# EAGLE schematic hanover-7320-20-01 (EAGLE 9.6.1), part 3 of 4
## Sheet 6 of 7: Dots R17-32 C1-16
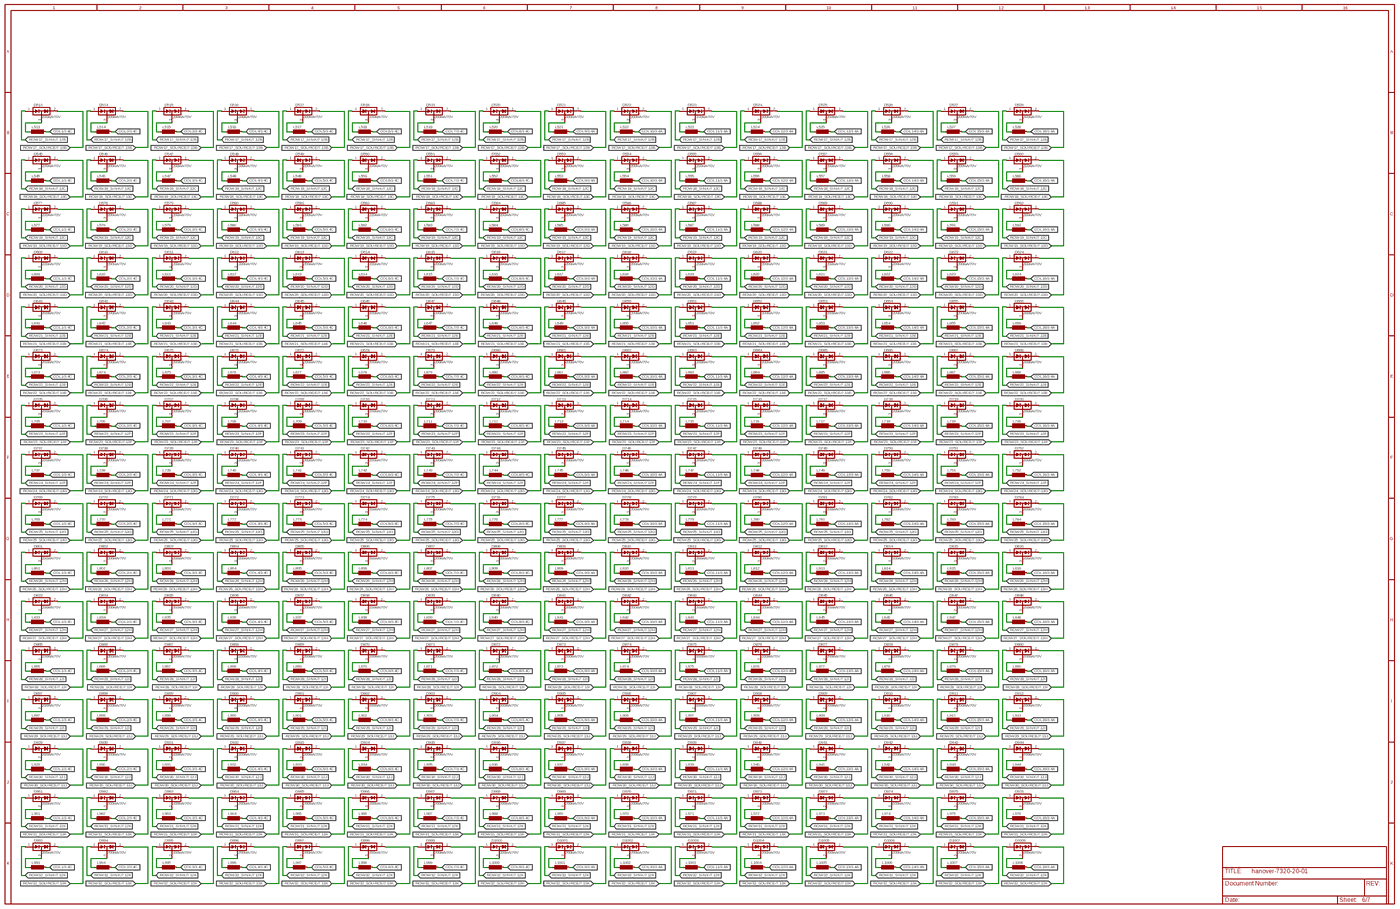
[diagram p9: schematic, sheet 6, overview]
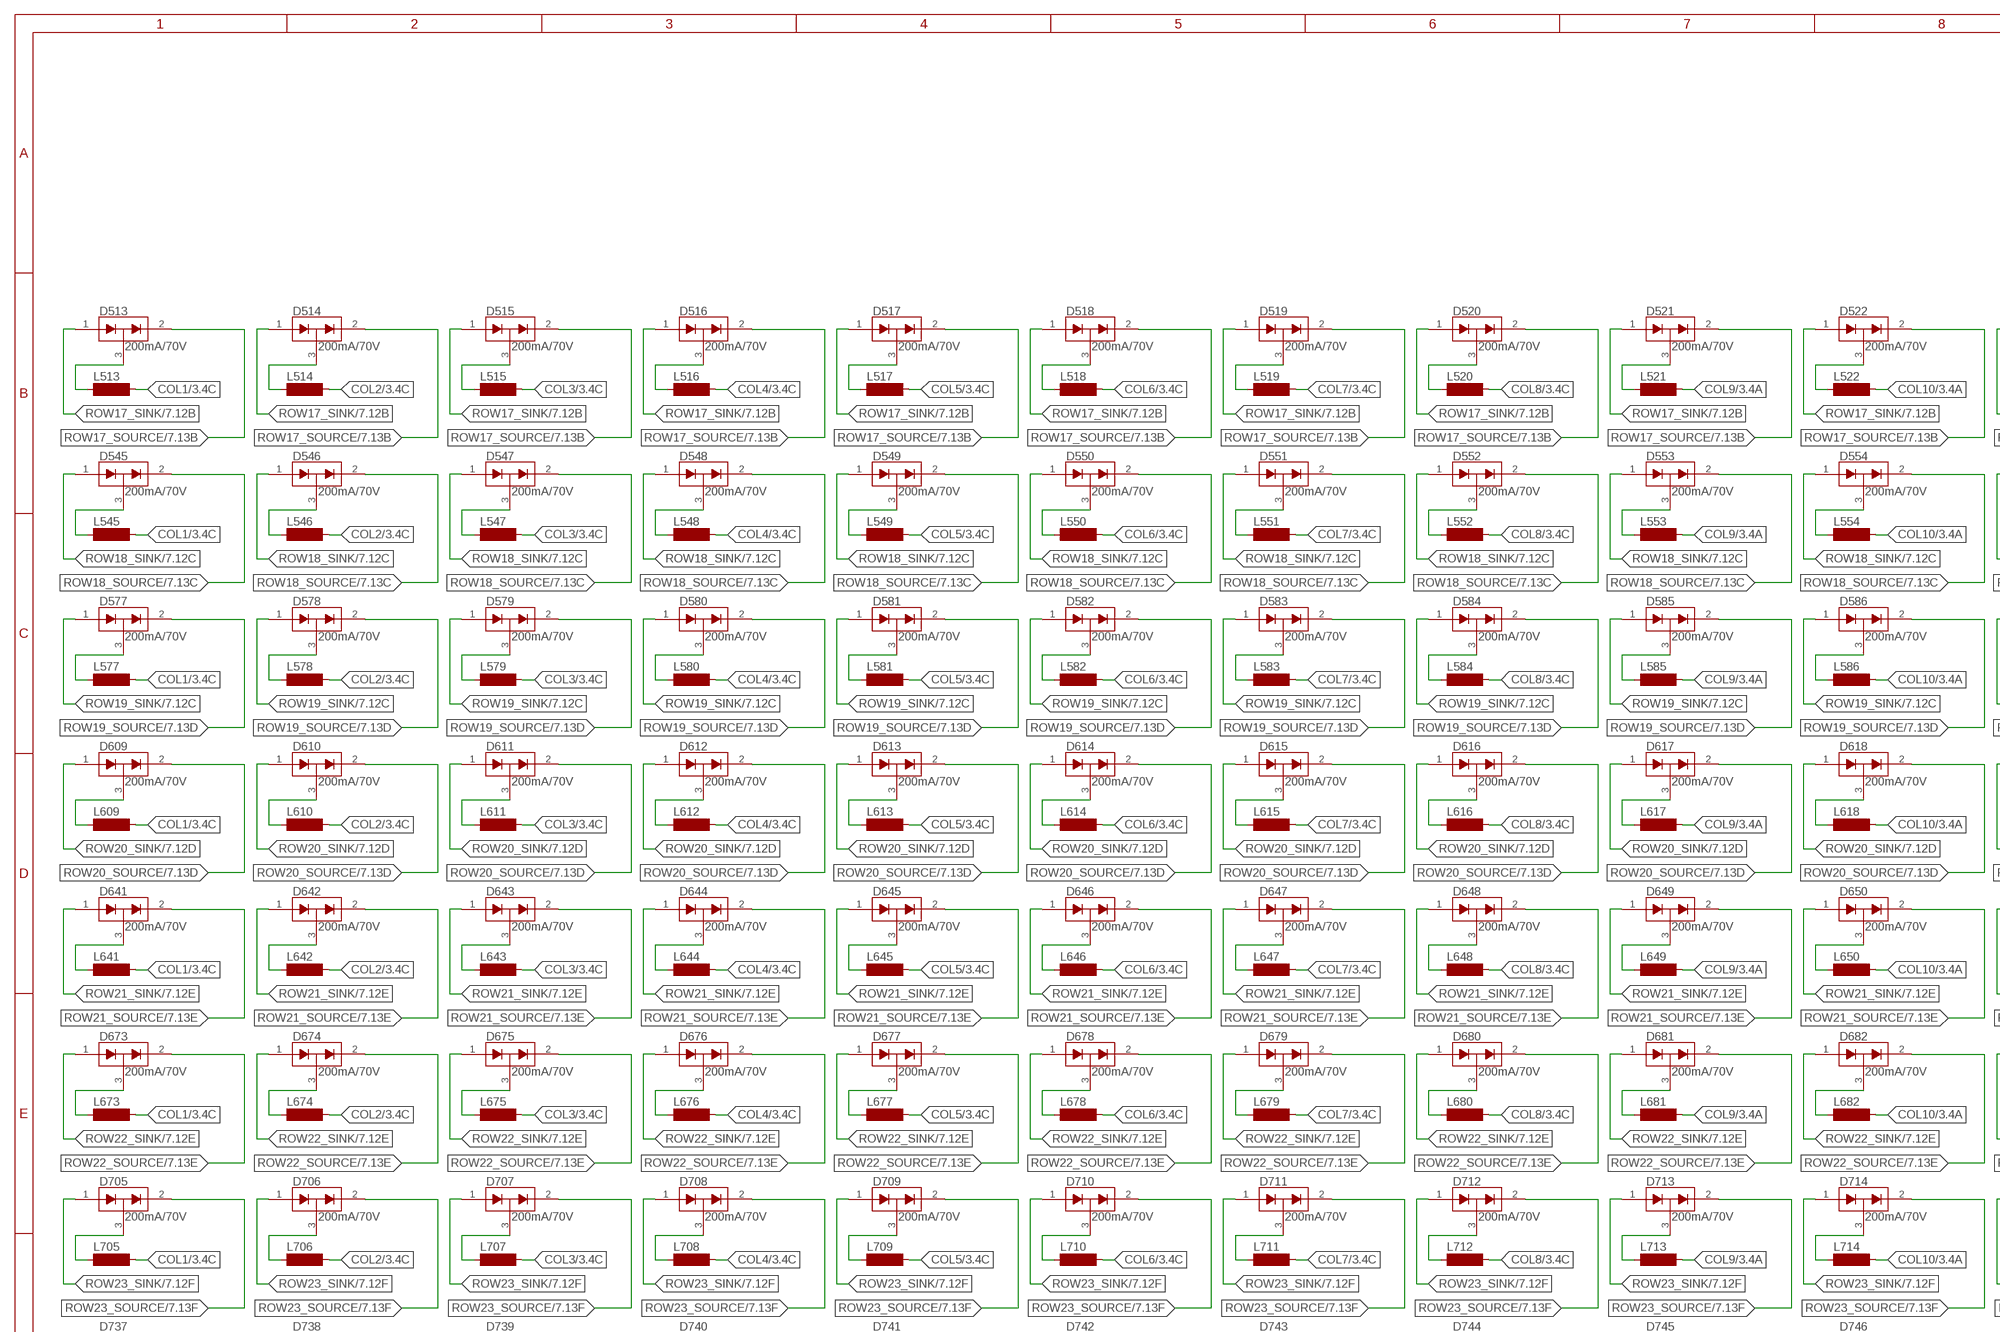
[diagram p10: schematic, sheet 6, part 1 of 4]
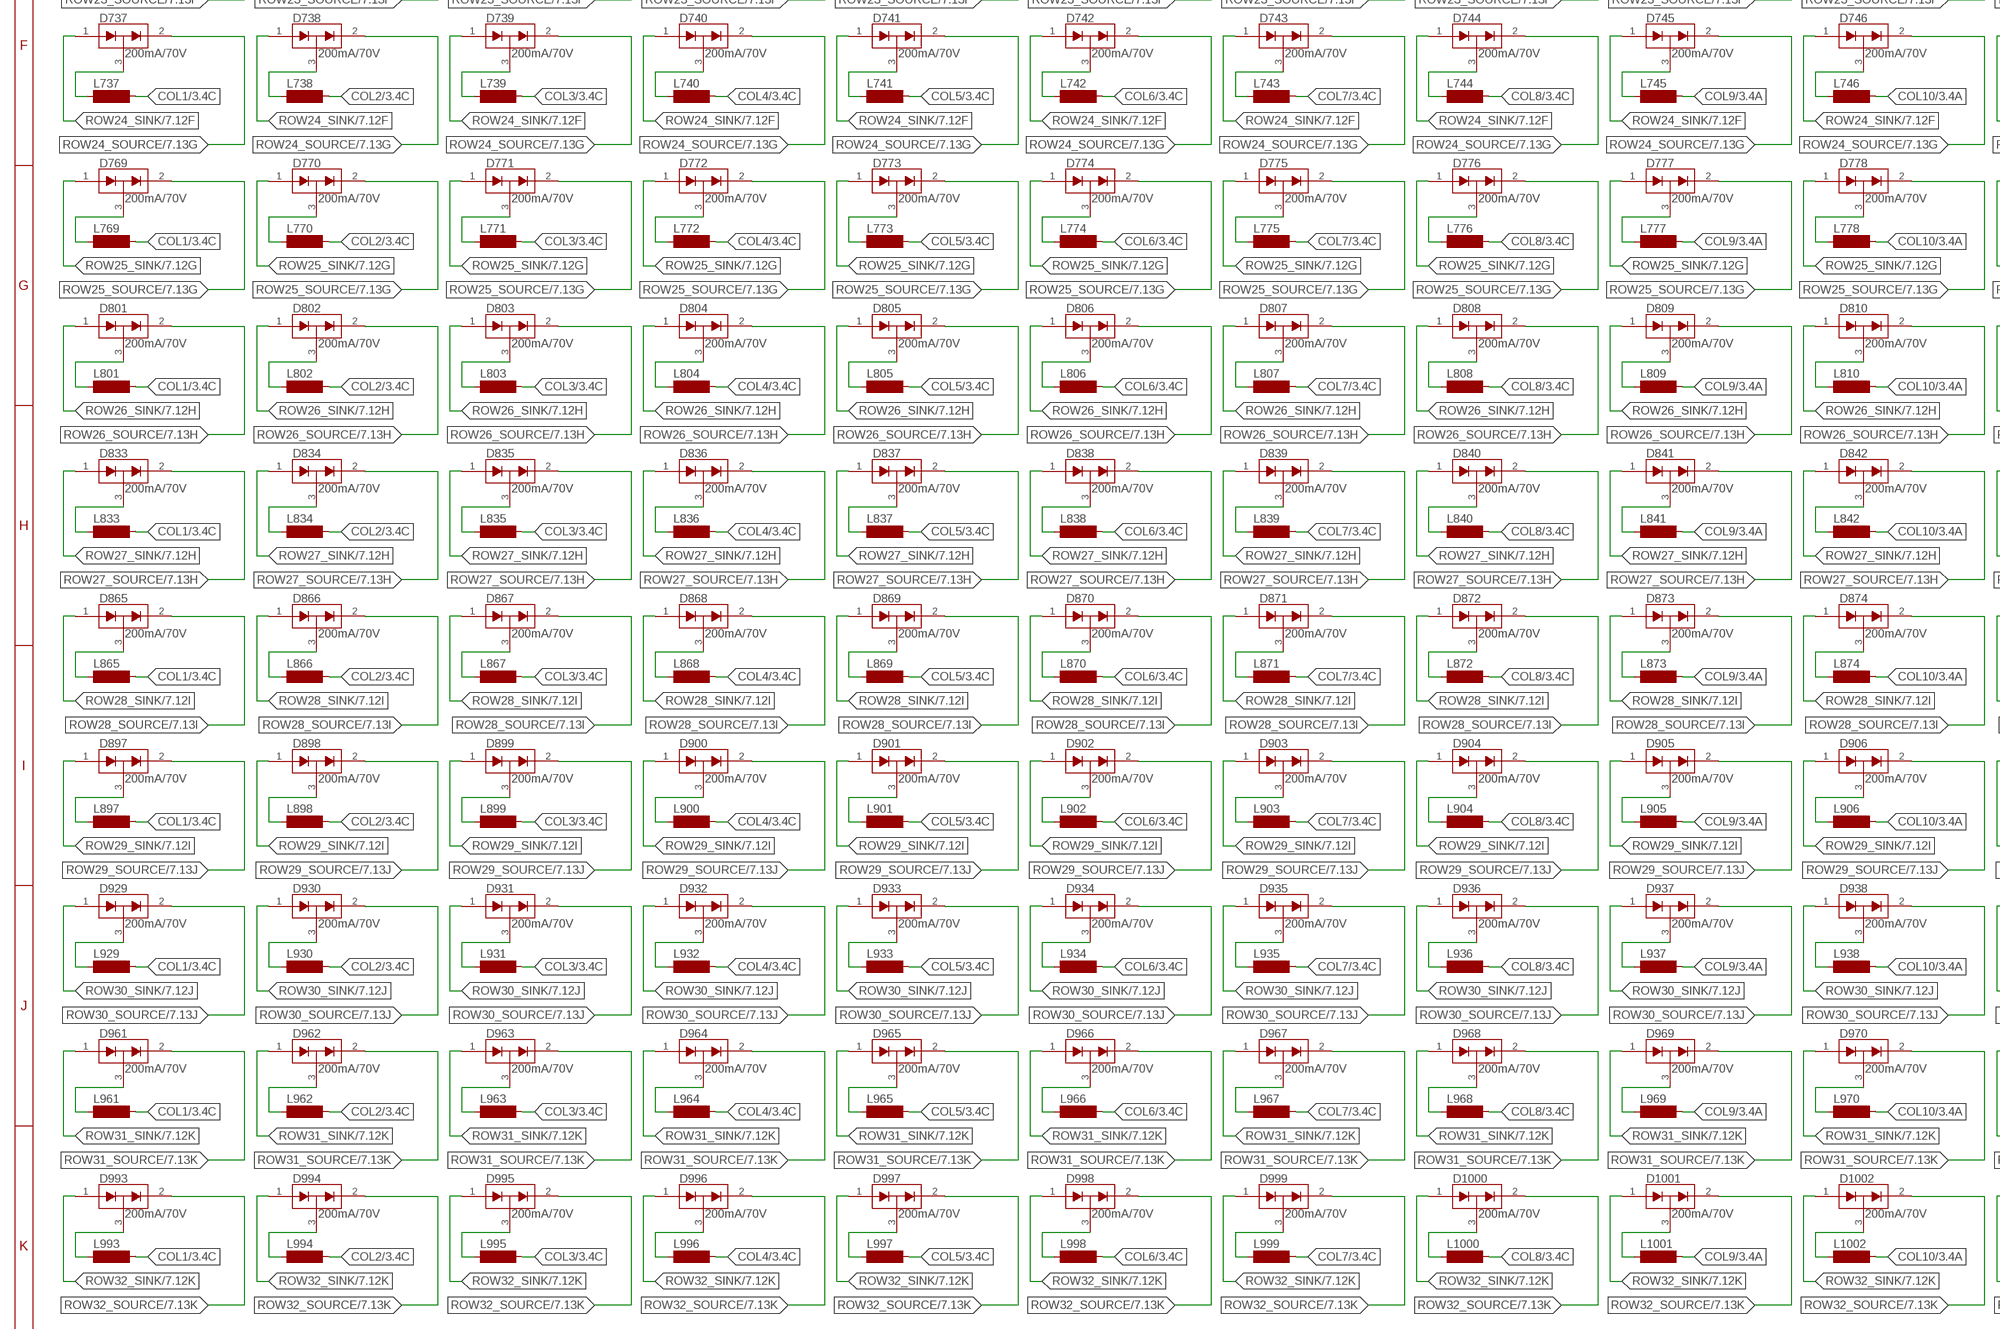
[diagram p11: schematic, sheet 6, part 2 of 4]
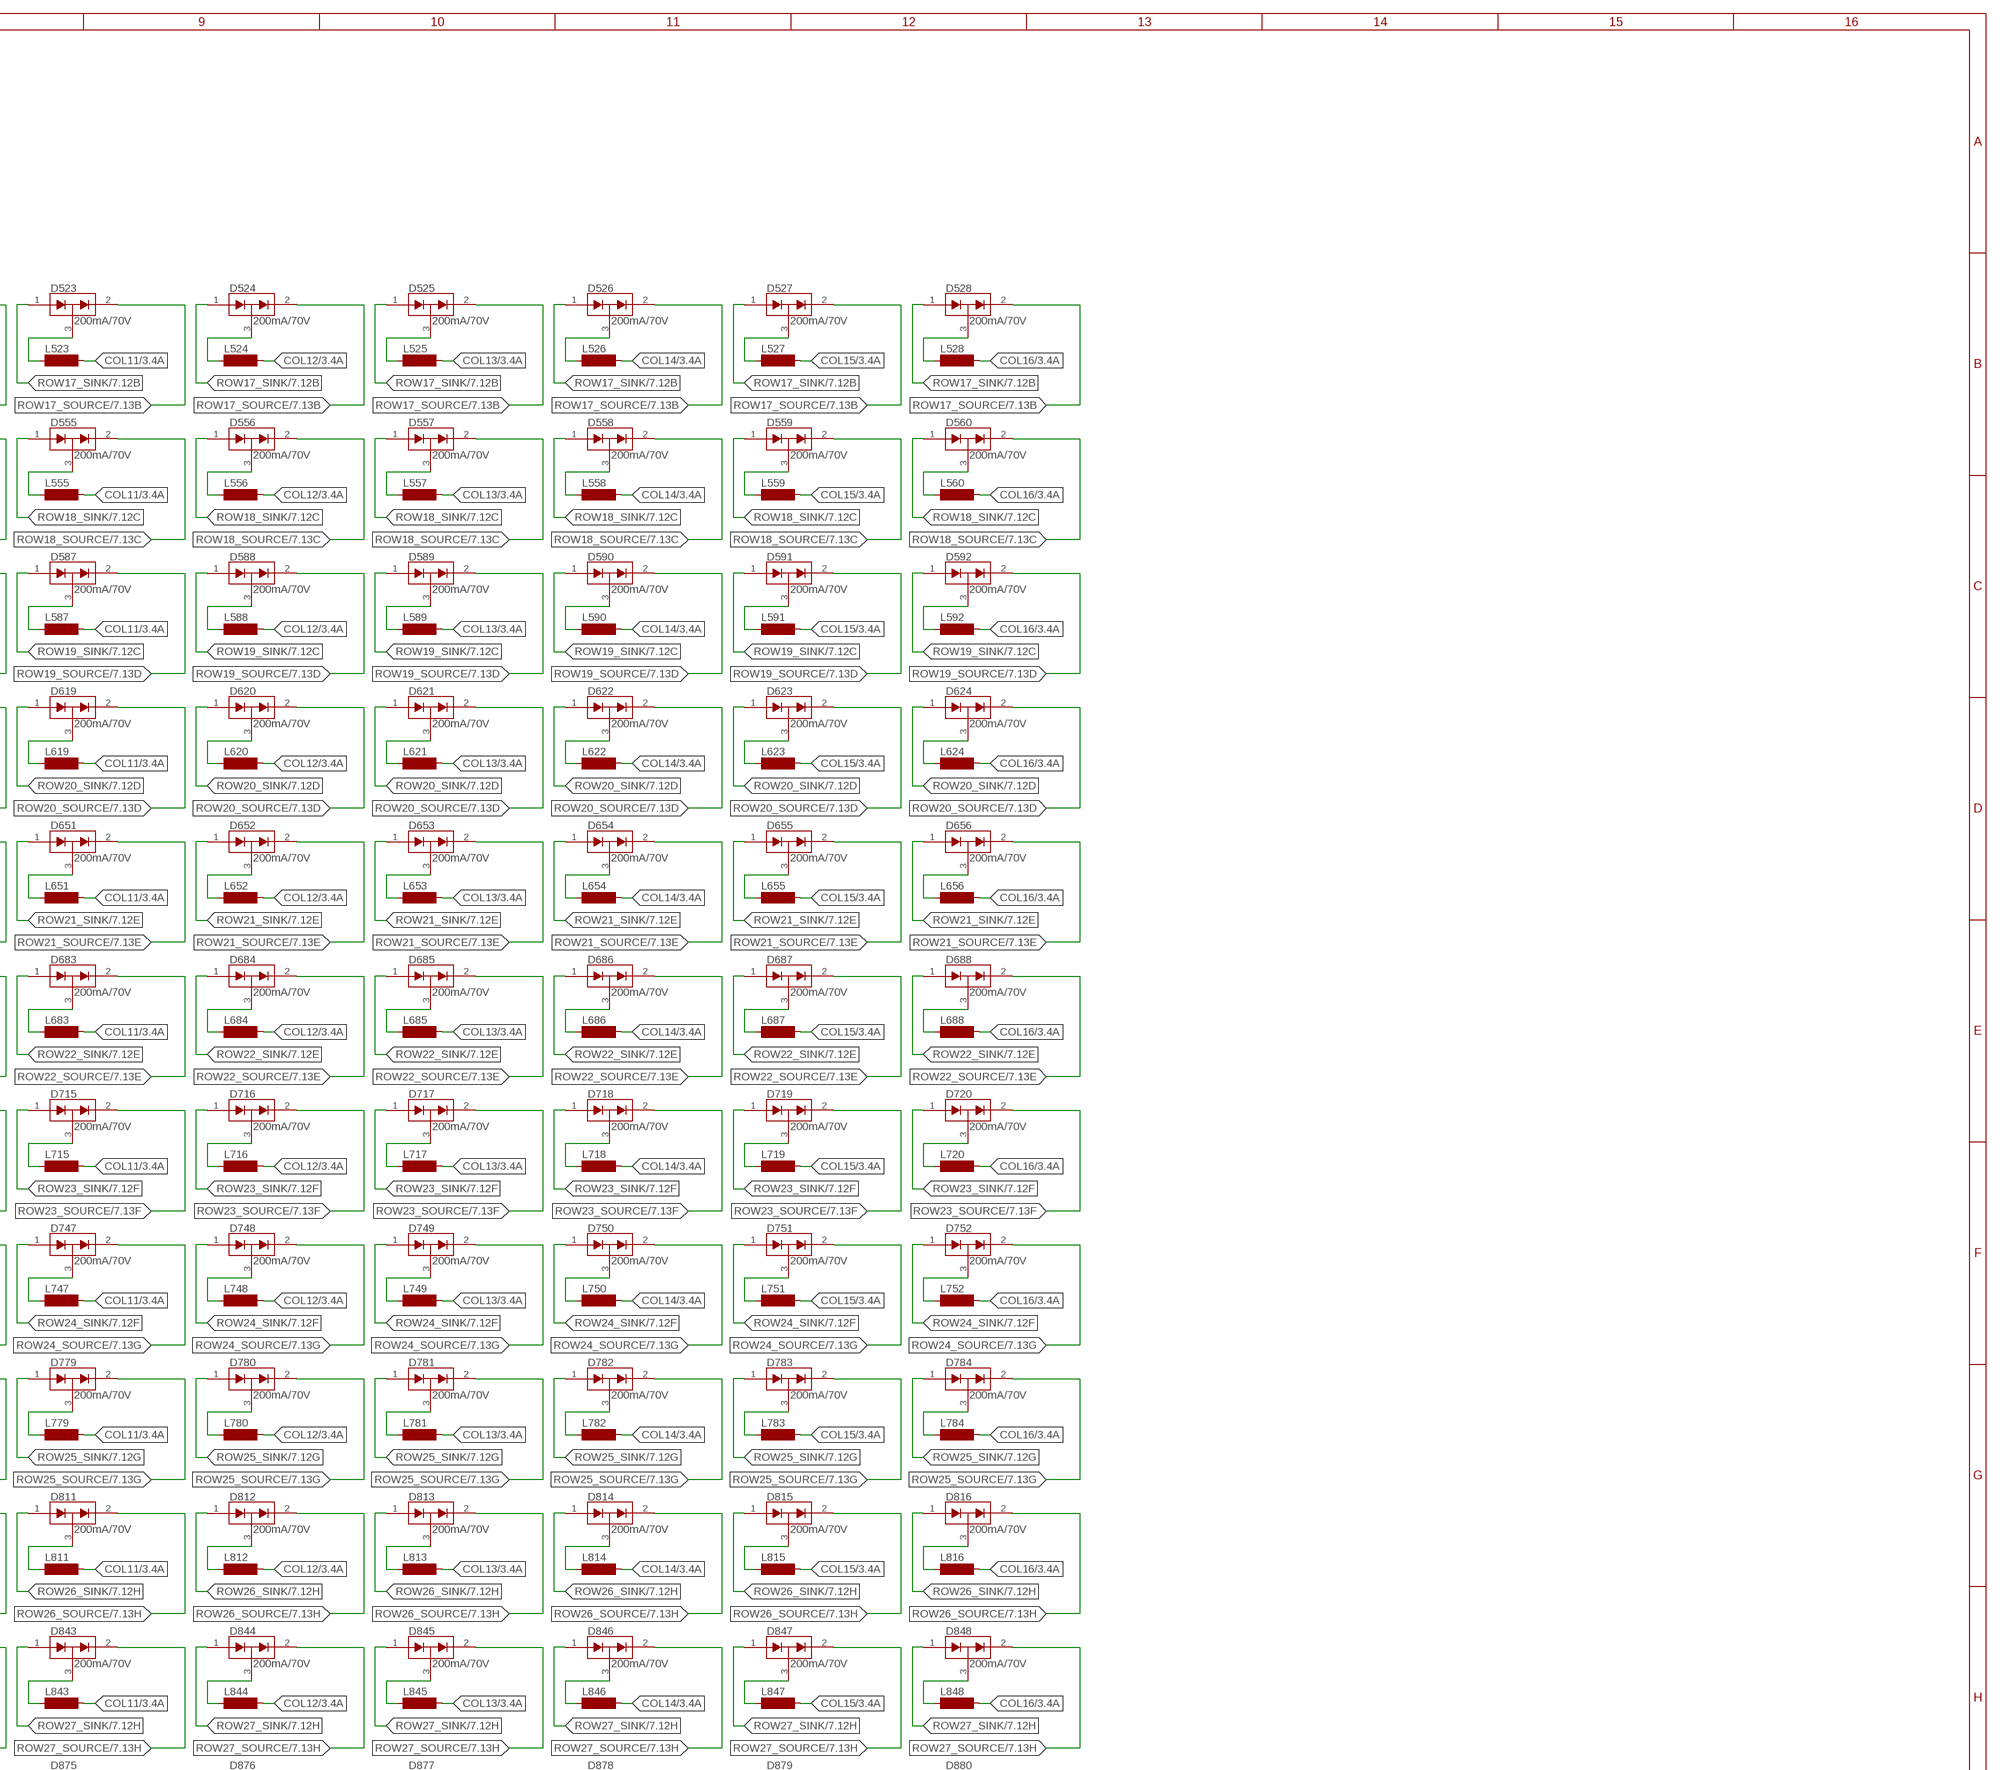
[diagram p12: schematic, sheet 6, part 3 of 4]
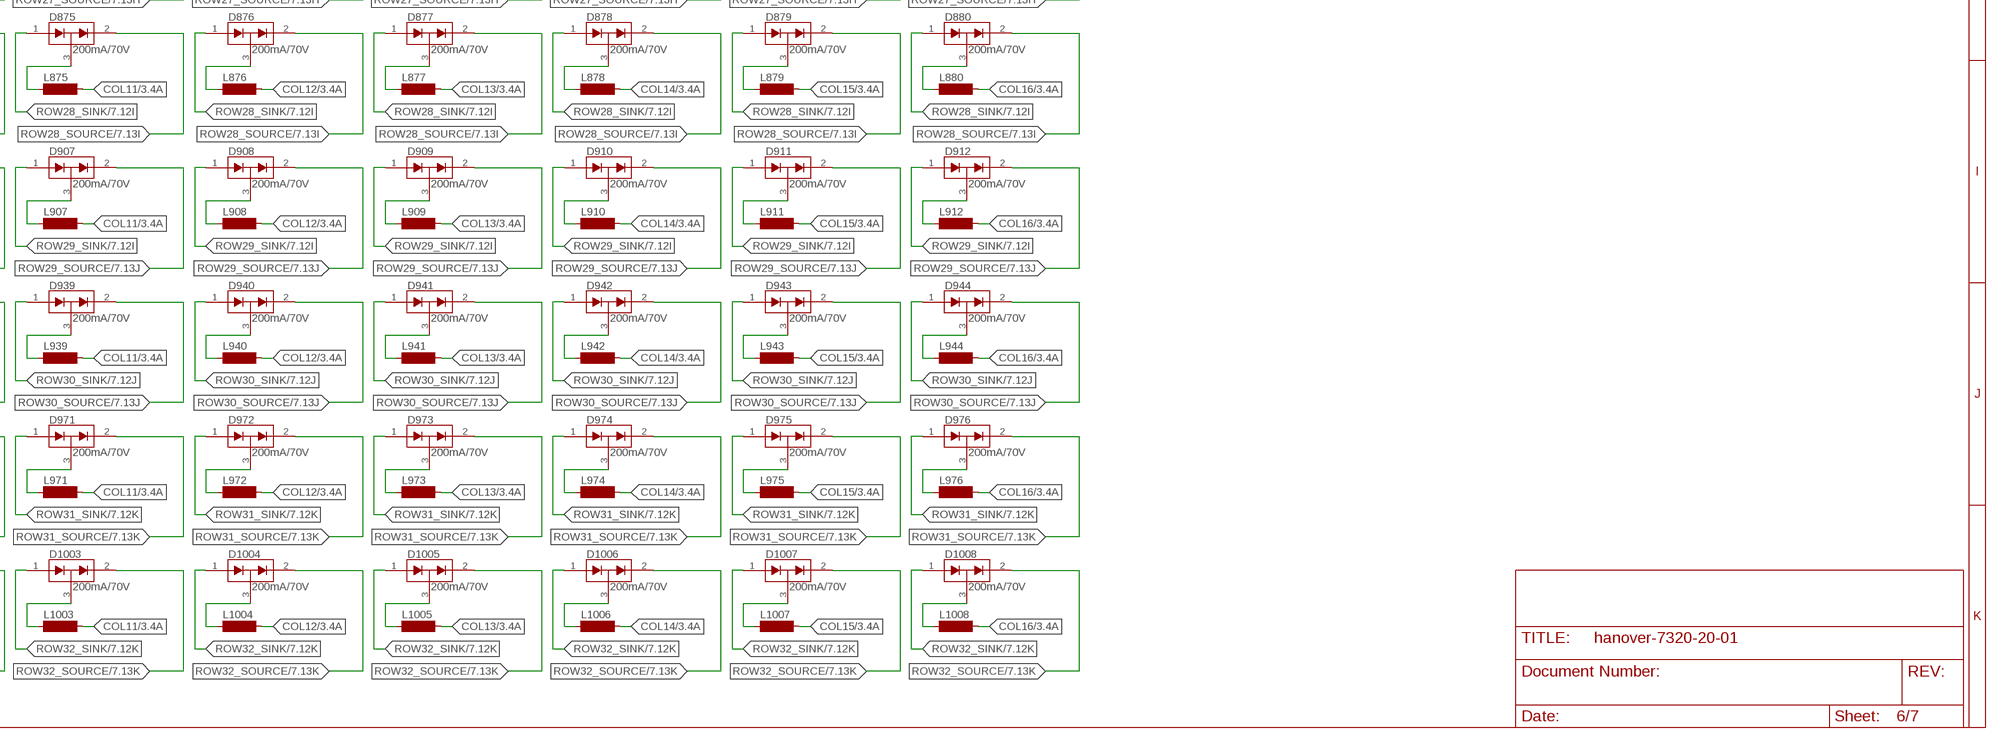
[diagram p13: schematic, sheet 6, part 4 of 4]

### Parts
D513  200mA/70V  BAV99  [SOT23-3]
D514  200mA/70V  BAV99  [SOT23-3]
D515  200mA/70V  BAV99  [SOT23-3]
D516  200mA/70V  BAV99  [SOT23-3]
D517  200mA/70V  BAV99  [SOT23-3]
D518  200mA/70V  BAV99  [SOT23-3]
D519  200mA/70V  BAV99  [SOT23-3]
D520  200mA/70V  BAV99  [SOT23-3]
D521  200mA/70V  BAV99  [SOT23-3]
D522  200mA/70V  BAV99  [SOT23-3]
D523  200mA/70V  BAV99  [SOT23-3]
D524  200mA/70V  BAV99  [SOT23-3]
D525  200mA/70V  BAV99  [SOT23-3]
D526  200mA/70V  BAV99  [SOT23-3]
D527  200mA/70V  BAV99  [SOT23-3]
D528  200mA/70V  BAV99  [SOT23-3]
D545  200mA/70V  BAV99  [SOT23-3]
D546  200mA/70V  BAV99  [SOT23-3]
D547  200mA/70V  BAV99  [SOT23-3]
D548  200mA/70V  BAV99  [SOT23-3]
D549  200mA/70V  BAV99  [SOT23-3]
D550  200mA/70V  BAV99  [SOT23-3]
D551  200mA/70V  BAV99  [SOT23-3]
D552  200mA/70V  BAV99  [SOT23-3]
D553  200mA/70V  BAV99  [SOT23-3]
D554  200mA/70V  BAV99  [SOT23-3]
D555  200mA/70V  BAV99  [SOT23-3]
D556  200mA/70V  BAV99  [SOT23-3]
D557  200mA/70V  BAV99  [SOT23-3]
D558  200mA/70V  BAV99  [SOT23-3]
D559  200mA/70V  BAV99  [SOT23-3]
D560  200mA/70V  BAV99  [SOT23-3]
D577  200mA/70V  BAV99  [SOT23-3]
D578  200mA/70V  BAV99  [SOT23-3]
D579  200mA/70V  BAV99  [SOT23-3]
D580  200mA/70V  BAV99  [SOT23-3]
D581  200mA/70V  BAV99  [SOT23-3]
D582  200mA/70V  BAV99  [SOT23-3]
D583  200mA/70V  BAV99  [SOT23-3]
D584  200mA/70V  BAV99  [SOT23-3]
D585  200mA/70V  BAV99  [SOT23-3]
D586  200mA/70V  BAV99  [SOT23-3]
D587  200mA/70V  BAV99  [SOT23-3]
D588  200mA/70V  BAV99  [SOT23-3]
D589  200mA/70V  BAV99  [SOT23-3]
D590  200mA/70V  BAV99  [SOT23-3]
D591  200mA/70V  BAV99  [SOT23-3]
D592  200mA/70V  BAV99  [SOT23-3]
D609  200mA/70V  BAV99  [SOT23-3]
D610  200mA/70V  BAV99  [SOT23-3]
D611  200mA/70V  BAV99  [SOT23-3]
D612  200mA/70V  BAV99  [SOT23-3]
D613  200mA/70V  BAV99  [SOT23-3]
D614  200mA/70V  BAV99  [SOT23-3]
D615  200mA/70V  BAV99  [SOT23-3]
D616  200mA/70V  BAV99  [SOT23-3]
D617  200mA/70V  BAV99  [SOT23-3]
D618  200mA/70V  BAV99  [SOT23-3]
D619  200mA/70V  BAV99  [SOT23-3]
D620  200mA/70V  BAV99  [SOT23-3]
D621  200mA/70V  BAV99  [SOT23-3]
D622  200mA/70V  BAV99  [SOT23-3]
D623  200mA/70V  BAV99  [SOT23-3]
D624  200mA/70V  BAV99  [SOT23-3]
D641  200mA/70V  BAV99  [SOT23-3]
D642  200mA/70V  BAV99  [SOT23-3]
D643  200mA/70V  BAV99  [SOT23-3]
D644  200mA/70V  BAV99  [SOT23-3]
D645  200mA/70V  BAV99  [SOT23-3]
D646  200mA/70V  BAV99  [SOT23-3]
D647  200mA/70V  BAV99  [SOT23-3]
D648  200mA/70V  BAV99  [SOT23-3]
D649  200mA/70V  BAV99  [SOT23-3]
D650  200mA/70V  BAV99  [SOT23-3]
D651  200mA/70V  BAV99  [SOT23-3]
D652  200mA/70V  BAV99  [SOT23-3]
D653  200mA/70V  BAV99  [SOT23-3]
D654  200mA/70V  BAV99  [SOT23-3]
D655  200mA/70V  BAV99  [SOT23-3]
D656  200mA/70V  BAV99  [SOT23-3]
D673  200mA/70V  BAV99  [SOT23-3]
D674  200mA/70V  BAV99  [SOT23-3]
D675  200mA/70V  BAV99  [SOT23-3]
D676  200mA/70V  BAV99  [SOT23-3]
D677  200mA/70V  BAV99  [SOT23-3]
D678  200mA/70V  BAV99  [SOT23-3]
D679  200mA/70V  BAV99  [SOT23-3]
D680  200mA/70V  BAV99  [SOT23-3]
D681  200mA/70V  BAV99  [SOT23-3]
D682  200mA/70V  BAV99  [SOT23-3]
D683  200mA/70V  BAV99  [SOT23-3]
D684  200mA/70V  BAV99  [SOT23-3]
D685  200mA/70V  BAV99  [SOT23-3]
D686  200mA/70V  BAV99  [SOT23-3]
D687  200mA/70V  BAV99  [SOT23-3]
D688  200mA/70V  BAV99  [SOT23-3]
D705  200mA/70V  BAV99  [SOT23-3]
D706  200mA/70V  BAV99  [SOT23-3]
D707  200mA/70V  BAV99  [SOT23-3]
D708  200mA/70V  BAV99  [SOT23-3]
D709  200mA/70V  BAV99  [SOT23-3]
D710  200mA/70V  BAV99  [SOT23-3]
D711  200mA/70V  BAV99  [SOT23-3]
D712  200mA/70V  BAV99  [SOT23-3]
D713  200mA/70V  BAV99  [SOT23-3]
D714  200mA/70V  BAV99  [SOT23-3]
D715  200mA/70V  BAV99  [SOT23-3]
D716  200mA/70V  BAV99  [SOT23-3]
D717  200mA/70V  BAV99  [SOT23-3]
D718  200mA/70V  BAV99  [SOT23-3]
D719  200mA/70V  BAV99  [SOT23-3]
D720  200mA/70V  BAV99  [SOT23-3]
D737  200mA/70V  BAV99  [SOT23-3]
D738  200mA/70V  BAV99  [SOT23-3]
D739  200mA/70V  BAV99  [SOT23-3]
D740  200mA/70V  BAV99  [SOT23-3]
D741  200mA/70V  BAV99  [SOT23-3]
D742  200mA/70V  BAV99  [SOT23-3]
D743  200mA/70V  BAV99  [SOT23-3]
D744  200mA/70V  BAV99  [SOT23-3]
D745  200mA/70V  BAV99  [SOT23-3]
D746  200mA/70V  BAV99  [SOT23-3]
D747  200mA/70V  BAV99  [SOT23-3]
D748  200mA/70V  BAV99  [SOT23-3]
D749  200mA/70V  BAV99  [SOT23-3]
D750  200mA/70V  BAV99  [SOT23-3]
D751  200mA/70V  BAV99  [SOT23-3]
D752  200mA/70V  BAV99  [SOT23-3]
D769  200mA/70V  BAV99  [SOT23-3]
D770  200mA/70V  BAV99  [SOT23-3]
D771  200mA/70V  BAV99  [SOT23-3]
D772  200mA/70V  BAV99  [SOT23-3]
D773  200mA/70V  BAV99  [SOT23-3]
D774  200mA/70V  BAV99  [SOT23-3]
D775  200mA/70V  BAV99  [SOT23-3]
D776  200mA/70V  BAV99  [SOT23-3]
D777  200mA/70V  BAV99  [SOT23-3]
D778  200mA/70V  BAV99  [SOT23-3]
D779  200mA/70V  BAV99  [SOT23-3]
D780  200mA/70V  BAV99  [SOT23-3]
D781  200mA/70V  BAV99  [SOT23-3]
D782  200mA/70V  BAV99  [SOT23-3]
D783  200mA/70V  BAV99  [SOT23-3]
D784  200mA/70V  BAV99  [SOT23-3]
D801  200mA/70V  BAV99  [SOT23-3]
D802  200mA/70V  BAV99  [SOT23-3]
D803  200mA/70V  BAV99  [SOT23-3]
D804  200mA/70V  BAV99  [SOT23-3]
D805  200mA/70V  BAV99  [SOT23-3]
D806  200mA/70V  BAV99  [SOT23-3]
D807  200mA/70V  BAV99  [SOT23-3]
D808  200mA/70V  BAV99  [SOT23-3]
D809  200mA/70V  BAV99  [SOT23-3]
D810  200mA/70V  BAV99  [SOT23-3]
D811  200mA/70V  BAV99  [SOT23-3]
D812  200mA/70V  BAV99  [SOT23-3]
D813  200mA/70V  BAV99  [SOT23-3]
D814  200mA/70V  BAV99  [SOT23-3]
D815  200mA/70V  BAV99  [SOT23-3]
D816  200mA/70V  BAV99  [SOT23-3]
D833  200mA/70V  BAV99  [SOT23-3]
D834  200mA/70V  BAV99  [SOT23-3]
D835  200mA/70V  BAV99  [SOT23-3]
D836  200mA/70V  BAV99  [SOT23-3]
D837  200mA/70V  BAV99  [SOT23-3]
D838  200mA/70V  BAV99  [SOT23-3]
D839  200mA/70V  BAV99  [SOT23-3]
D840  200mA/70V  BAV99  [SOT23-3]
D841  200mA/70V  BAV99  [SOT23-3]
D842  200mA/70V  BAV99  [SOT23-3]
D843  200mA/70V  BAV99  [SOT23-3]
D844  200mA/70V  BAV99  [SOT23-3]
D845  200mA/70V  BAV99  [SOT23-3]
D846  200mA/70V  BAV99  [SOT23-3]
D847  200mA/70V  BAV99  [SOT23-3]
D848  200mA/70V  BAV99  [SOT23-3]
D865  200mA/70V  BAV99  [SOT23-3]
D866  200mA/70V  BAV99  [SOT23-3]
D867  200mA/70V  BAV99  [SOT23-3]
D868  200mA/70V  BAV99  [SOT23-3]
D869  200mA/70V  BAV99  [SOT23-3]
D870  200mA/70V  BAV99  [SOT23-3]
D871  200mA/70V  BAV99  [SOT23-3]
D872  200mA/70V  BAV99  [SOT23-3]
D873  200mA/70V  BAV99  [SOT23-3]
D874  200mA/70V  BAV99  [SOT23-3]
D875  200mA/70V  BAV99  [SOT23-3]
D876  200mA/70V  BAV99  [SOT23-3]
D877  200mA/70V  BAV99  [SOT23-3]
D878  200mA/70V  BAV99  [SOT23-3]
D879  200mA/70V  BAV99  [SOT23-3]
D880  200mA/70V  BAV99  [SOT23-3]
D897  200mA/70V  BAV99  [SOT23-3]
D898  200mA/70V  BAV99  [SOT23-3]
D899  200mA/70V  BAV99  [SOT23-3]
D900  200mA/70V  BAV99  [SOT23-3]
D901  200mA/70V  BAV99  [SOT23-3]
D902  200mA/70V  BAV99  [SOT23-3]
D903  200mA/70V  BAV99  [SOT23-3]
D904  200mA/70V  BAV99  [SOT23-3]
D905  200mA/70V  BAV99  [SOT23-3]
D906  200mA/70V  BAV99  [SOT23-3]
D907  200mA/70V  BAV99  [SOT23-3]
D908  200mA/70V  BAV99  [SOT23-3]
D909  200mA/70V  BAV99  [SOT23-3]
D910  200mA/70V  BAV99  [SOT23-3]
D911  200mA/70V  BAV99  [SOT23-3]
D912  200mA/70V  BAV99  [SOT23-3]
D929  200mA/70V  BAV99  [SOT23-3]
D930  200mA/70V  BAV99  [SOT23-3]
D931  200mA/70V  BAV99  [SOT23-3]
D932  200mA/70V  BAV99  [SOT23-3]
D933  200mA/70V  BAV99  [SOT23-3]
D934  200mA/70V  BAV99  [SOT23-3]
D935  200mA/70V  BAV99  [SOT23-3]
D936  200mA/70V  BAV99  [SOT23-3]
D937  200mA/70V  BAV99  [SOT23-3]
D938  200mA/70V  BAV99  [SOT23-3]
D939  200mA/70V  BAV99  [SOT23-3]
D940  200mA/70V  BAV99  [SOT23-3]
D941  200mA/70V  BAV99  [SOT23-3]
D942  200mA/70V  BAV99  [SOT23-3]
D943  200mA/70V  BAV99  [SOT23-3]
D944  200mA/70V  BAV99  [SOT23-3]
D961  200mA/70V  BAV99  [SOT23-3]
D962  200mA/70V  BAV99  [SOT23-3]
D963  200mA/70V  BAV99  [SOT23-3]
D964  200mA/70V  BAV99  [SOT23-3]
D965  200mA/70V  BAV99  [SOT23-3]
D966  200mA/70V  BAV99  [SOT23-3]
D967  200mA/70V  BAV99  [SOT23-3]
D968  200mA/70V  BAV99  [SOT23-3]
D969  200mA/70V  BAV99  [SOT23-3]
D970  200mA/70V  BAV99  [SOT23-3]
D971  200mA/70V  BAV99  [SOT23-3]
D972  200mA/70V  BAV99  [SOT23-3]
D973  200mA/70V  BAV99  [SOT23-3]
D974  200mA/70V  BAV99  [SOT23-3]
D975  200mA/70V  BAV99  [SOT23-3]
D976  200mA/70V  BAV99  [SOT23-3]
D993  200mA/70V  BAV99  [SOT23-3]
D994  200mA/70V  BAV99  [SOT23-3]
D995  200mA/70V  BAV99  [SOT23-3]
D996  200mA/70V  BAV99  [SOT23-3]
D997  200mA/70V  BAV99  [SOT23-3]
D998  200mA/70V  BAV99  [SOT23-3]
D999  200mA/70V  BAV99  [SOT23-3]
D1000  200mA/70V  BAV99  [SOT23-3]
D1001  200mA/70V  BAV99  [SOT23-3]
D1002  200mA/70V  BAV99  [SOT23-3]
D1003  200mA/70V  BAV99  [SOT23-3]
D1004  200mA/70V  BAV99  [SOT23-3]
D1005  200mA/70V  BAV99  [SOT23-3]
D1006  200mA/70V  BAV99  [SOT23-3]
D1007  200mA/70V  BAV99  [SOT23-3]
D1008  200mA/70V  BAV99  [SOT23-3]
L513  SD8  [SD8]
L514  SD8  [SD8]
L515  SD8  [SD8]
L516  SD8  [SD8]
L517  SD8  [SD8]
L518  SD8  [SD8]
L519  SD8  [SD8]
L520  SD8  [SD8]
L521  SD8  [SD8]
L522  SD8  [SD8]
L523  SD8  [SD8]
L524  SD8  [SD8]
L525  SD8  [SD8]
L526  SD8  [SD8]
L527  SD8  [SD8]
L528  SD8  [SD8]
L545  SD8  [SD8]
L546  SD8  [SD8]
L547  SD8  [SD8]
L548  SD8  [SD8]
L549  SD8  [SD8]
L550  SD8  [SD8]
L551  SD8  [SD8]
L552  SD8  [SD8]
L553  SD8  [SD8]
L554  SD8  [SD8]
L555  SD8  [SD8]
L556  SD8  [SD8]
L557  SD8  [SD8]
L558  SD8  [SD8]
L559  SD8  [SD8]
L560  SD8  [SD8]
L577  SD8  [SD8]
L578  SD8  [SD8]
L579  SD8  [SD8]
L580  SD8  [SD8]
L581  SD8  [SD8]
L582  SD8  [SD8]
L583  SD8  [SD8]
L584  SD8  [SD8]
L585  SD8  [SD8]
L586  SD8  [SD8]
L587  SD8  [SD8]
L588  SD8  [SD8]
L589  SD8  [SD8]
L590  SD8  [SD8]
L591  SD8  [SD8]
L592  SD8  [SD8]
L609  SD8  [SD8]
L610  SD8  [SD8]
L611  SD8  [SD8]
L612  SD8  [SD8]
L613  SD8  [SD8]
L614  SD8  [SD8]
L615  SD8  [SD8]
L616  SD8  [SD8]
L617  SD8  [SD8]
L618  SD8  [SD8]
L619  SD8  [SD8]
L620  SD8  [SD8]
L621  SD8  [SD8]
L622  SD8  [SD8]
L623  SD8  [SD8]
L624  SD8  [SD8]
L641  SD8  [SD8]
L642  SD8  [SD8]
L643  SD8  [SD8]
L644  SD8  [SD8]
L645  SD8  [SD8]
L646  SD8  [SD8]
L647  SD8  [SD8]
L648  SD8  [SD8]
L649  SD8  [SD8]
L650  SD8  [SD8]
L651  SD8  [SD8]
L652  SD8  [SD8]
L653  SD8  [SD8]
L654  SD8  [SD8]
L655  SD8  [SD8]
L656  SD8  [SD8]
L673  SD8  [SD8]
L674  SD8  [SD8]
L675  SD8  [SD8]
L676  SD8  [SD8]
L677  SD8  [SD8]
L678  SD8  [SD8]
L679  SD8  [SD8]
L680  SD8  [SD8]
L681  SD8  [SD8]
L682  SD8  [SD8]
L683  SD8  [SD8]
L684  SD8  [SD8]
L685  SD8  [SD8]
L686  SD8  [SD8]
L687  SD8  [SD8]
L688  SD8  [SD8]
L705  SD8  [SD8]
L706  SD8  [SD8]
L707  SD8  [SD8]
L708  SD8  [SD8]
L709  SD8  [SD8]
L710  SD8  [SD8]
L711  SD8  [SD8]
L712  SD8  [SD8]
L713  SD8  [SD8]
L714  SD8  [SD8]
L715  SD8  [SD8]
L716  SD8  [SD8]
L717  SD8  [SD8]
L718  SD8  [SD8]
L719  SD8  [SD8]
L720  SD8  [SD8]
L737  SD8  [SD8]
L738  SD8  [SD8]
L739  SD8  [SD8]
L740  SD8  [SD8]
L741  SD8  [SD8]
L742  SD8  [SD8]
L743  SD8  [SD8]
L744  SD8  [SD8]
L745  SD8  [SD8]
L746  SD8  [SD8]
L747  SD8  [SD8]
L748  SD8  [SD8]
L749  SD8  [SD8]
L750  SD8  [SD8]
L751  SD8  [SD8]
L752  SD8  [SD8]
L769  SD8  [SD8]
L770  SD8  [SD8]
L771  SD8  [SD8]
L772  SD8  [SD8]
L773  SD8  [SD8]
L774  SD8  [SD8]
L775  SD8  [SD8]
L776  SD8  [SD8]
L777  SD8  [SD8]
L778  SD8  [SD8]
L779  SD8  [SD8]
L780  SD8  [SD8]
L781  SD8  [SD8]
L782  SD8  [SD8]
L783  SD8  [SD8]
L784  SD8  [SD8]
L801  SD8  [SD8]
L802  SD8  [SD8]
L803  SD8  [SD8]
L804  SD8  [SD8]
L805  SD8  [SD8]
L806  SD8  [SD8]
L807  SD8  [SD8]
L808  SD8  [SD8]
L809  SD8  [SD8]
L810  SD8  [SD8]
L811  SD8  [SD8]
L812  SD8  [SD8]
L813  SD8  [SD8]
L814  SD8  [SD8]
L815  SD8  [SD8]
L816  SD8  [SD8]
L833  SD8  [SD8]
L834  SD8  [SD8]
L835  SD8  [SD8]
L836  SD8  [SD8]
L837  SD8  [SD8]
L838  SD8  [SD8]
L839  SD8  [SD8]
L840  SD8  [SD8]
L841  SD8  [SD8]
L842  SD8  [SD8]
L843  SD8  [SD8]
L844  SD8  [SD8]
L845  SD8  [SD8]
L846  SD8  [SD8]
L847  SD8  [SD8]
L848  SD8  [SD8]
L865  SD8  [SD8]
L866  SD8  [SD8]
L867  SD8  [SD8]
L868  SD8  [SD8]
L869  SD8  [SD8]
L870  SD8  [SD8]
L871  SD8  [SD8]
L872  SD8  [SD8]
L873  SD8  [SD8]
L874  SD8  [SD8]
L875  SD8  [SD8]
L876  SD8  [SD8]
L877  SD8  [SD8]
L878  SD8  [SD8]
L879  SD8  [SD8]
L880  SD8  [SD8]
L897  SD8  [SD8]
L898  SD8  [SD8]
L899  SD8  [SD8]
L900  SD8  [SD8]
L901  SD8  [SD8]
L902  SD8  [SD8]
L903  SD8  [SD8]
L904  SD8  [SD8]
L905  SD8  [SD8]
L906  SD8  [SD8]
L907  SD8  [SD8]
L908  SD8  [SD8]
L909  SD8  [SD8]
L910  SD8  [SD8]
L911  SD8  [SD8]
L912  SD8  [SD8]
L929  SD8  [SD8]
L930  SD8  [SD8]
L931  SD8  [SD8]
L932  SD8  [SD8]
L933  SD8  [SD8]
L934  SD8  [SD8]
L935  SD8  [SD8]
L936  SD8  [SD8]
L937  SD8  [SD8]
L938  SD8  [SD8]
L939  SD8  [SD8]
L940  SD8  [SD8]
L941  SD8  [SD8]
L942  SD8  [SD8]
L943  SD8  [SD8]
L944  SD8  [SD8]
L961  SD8  [SD8]
L962  SD8  [SD8]
L963  SD8  [SD8]
L964  SD8  [SD8]
L965  SD8  [SD8]
L966  SD8  [SD8]
L967  SD8  [SD8]
L968  SD8  [SD8]
L969  SD8  [SD8]
L970  SD8  [SD8]
L971  SD8  [SD8]
L972  SD8  [SD8]
L973  SD8  [SD8]
L974  SD8  [SD8]
L975  SD8  [SD8]
L976  SD8  [SD8]
L993  SD8  [SD8]
L994  SD8  [SD8]
L995  SD8  [SD8]
L996  SD8  [SD8]
L997  SD8  [SD8]
L998  SD8  [SD8]
L999  SD8  [SD8]
L1000  SD8  [SD8]
L1001  SD8  [SD8]
L1002  SD8  [SD8]
L1003  SD8  [SD8]
L1004  SD8  [SD8]
L1005  SD8  [SD8]
L1006  SD8  [SD8]
L1007  SD8  [SD8]
L1008  SD8  [SD8]

### Nets
COL1: L513.2 L545.2 L577.2 L609.2 L641.2 L673.2 L705.2 L737.2 L769.2 L801.2 L833.2 L865.2 L897.2 L929.2 L961.2 L993.2 ; also sheet 3,4
COL2: L514.2 L546.2 L578.2 L610.2 L642.2 L674.2 L706.2 L738.2 L770.2 L802.2 L834.2 L866.2 L898.2 L930.2 L962.2 L994.2 ; also sheet 3,4
COL3: L515.2 L547.2 L579.2 L611.2 L643.2 L675.2 L707.2 L739.2 L771.2 L803.2 L835.2 L867.2 L899.2 L931.2 L963.2 L995.2 ; also sheet 3,4
COL4: L516.2 L548.2 L580.2 L612.2 L644.2 L676.2 L708.2 L740.2 L772.2 L804.2 L836.2 L868.2 L900.2 L932.2 L964.2 L996.2 ; also sheet 3,4
COL5: L517.2 L549.2 L581.2 L613.2 L645.2 L677.2 L709.2 L741.2 L773.2 L805.2 L837.2 L869.2 L901.2 L933.2 L965.2 L997.2 ; also sheet 3,4
COL6: L518.2 L550.2 L582.2 L614.2 L646.2 L678.2 L710.2 L742.2 L774.2 L806.2 L838.2 L870.2 L902.2 L934.2 L966.2 L998.2 ; also sheet 3,4
COL7: L519.2 L551.2 L583.2 L615.2 L647.2 L679.2 L711.2 L743.2 L775.2 L807.2 L839.2 L871.2 L903.2 L935.2 L967.2 L999.2 ; also sheet 3,4
COL8: L520.2 L552.2 L584.2 L616.2 L648.2 L680.2 L712.2 L744.2 L776.2 L808.2 L840.2 L872.2 L904.2 L936.2 L968.2 L1000.2 ; also sheet 3,4
COL9: L521.2 L553.2 L585.2 L617.2 L649.2 L681.2 L713.2 L745.2 L777.2 L809.2 L841.2 L873.2 L905.2 L937.2 L969.2 L1001.2 ; also sheet 3,4
COL10: L522.2 L554.2 L586.2 L618.2 L650.2 L682.2 L714.2 L746.2 L778.2 L810.2 L842.2 L874.2 L906.2 L938.2 L970.2 L1002.2 ; also sheet 3,4
COL11: L523.2 L555.2 L587.2 L619.2 L651.2 L683.2 L715.2 L747.2 L779.2 L811.2 L843.2 L875.2 L907.2 L939.2 L971.2 L1003.2 ; also sheet 3,4
COL12: L524.2 L556.2 L588.2 L620.2 L652.2 L684.2 L716.2 L748.2 L780.2 L812.2 L844.2 L876.2 L908.2 L940.2 L972.2 L1004.2 ; also sheet 3,4
COL13: L525.2 L557.2 L589.2 L621.2 L653.2 L685.2 L717.2 L749.2 L781.2 L813.2 L845.2 L877.2 L909.2 L941.2 L973.2 L1005.2 ; also sheet 3,4
COL14: L526.2 L558.2 L590.2 L622.2 L654.2 L686.2 L718.2 L750.2 L782.2 L814.2 L846.2 L878.2 L910.2 L942.2 L974.2 L1006.2 ; also sheet 3,4
COL15: L527.2 L559.2 L591.2 L623.2 L655.2 L687.2 L719.2 L751.2 L783.2 L815.2 L847.2 L879.2 L911.2 L943.2 L975.2 L1007.2 ; also sheet 3,4
COL16: L528.2 L560.2 L592.2 L624.2 L656.2 L688.2 L720.2 L752.2 L784.2 L816.2 L848.2 L880.2 L912.2 L944.2 L976.2 L1008.2 ; also sheet 3,4
N$527: D513.3(COM) L513.1
N$528: D514.3(COM) L514.1
N$529: D515.3(COM) L515.1
N$530: D516.3(COM) L516.1
N$531: D517.3(COM) L517.1
N$532: D518.3(COM) L518.1
N$533: D519.3(COM) L519.1
N$534: D520.3(COM) L520.1
N$535: D521.3(COM) L521.1
N$536: D522.3(COM) L522.1
N$537: D523.3(COM) L523.1
N$538: D524.3(COM) L524.1
N$539: D525.3(COM) L525.1
N$540: D526.3(COM) L526.1
N$541: D527.3(COM) L527.1
N$542: D528.3(COM) L528.1
N$559: D545.3(COM) L545.1
N$560: D546.3(COM) L546.1
N$561: D547.3(COM) L547.1
N$562: D548.3(COM) L548.1
N$563: D549.3(COM) L549.1
N$564: D550.3(COM) L550.1
N$565: D551.3(COM) L551.1
N$566: D552.3(COM) L552.1
N$567: D553.3(COM) L553.1
N$568: D554.3(COM) L554.1
N$569: D555.3(COM) L555.1
N$570: D556.3(COM) L556.1
N$571: D557.3(COM) L557.1
N$572: D558.3(COM) L558.1
N$573: D559.3(COM) L559.1
N$574: D560.3(COM) L560.1
N$591: D577.3(COM) L577.1
N$592: D578.3(COM) L578.1
N$593: D579.3(COM) L579.1
N$594: D580.3(COM) L580.1
N$595: D581.3(COM) L581.1
N$596: D582.3(COM) L582.1
N$597: D583.3(COM) L583.1
N$598: D584.3(COM) L584.1
N$599: D585.3(COM) L585.1
N$600: D586.3(COM) L586.1
N$601: D587.3(COM) L587.1
N$602: D588.3(COM) L588.1
N$603: D589.3(COM) L589.1
N$604: D590.3(COM) L590.1
N$605: D591.3(COM) L591.1
N$606: D592.3(COM) L592.1
N$623: D609.3(COM) L609.1
N$624: D610.3(COM) L610.1
N$625: D611.3(COM) L611.1
N$626: D612.3(COM) L612.1
N$627: D613.3(COM) L613.1
N$628: D614.3(COM) L614.1
N$629: D615.3(COM) L615.1
N$630: D616.3(COM) L616.1
N$631: D617.3(COM) L617.1
N$632: D618.3(COM) L618.1
N$633: D619.3(COM) L619.1
N$634: D620.3(COM) L620.1
N$635: D621.3(COM) L621.1
N$636: D622.3(COM) L622.1
N$637: D623.3(COM) L623.1
N$638: D624.3(COM) L624.1
N$655: D641.3(COM) L641.1
N$656: D642.3(COM) L642.1
N$657: D643.3(COM) L643.1
N$658: D644.3(COM) L644.1
N$659: D645.3(COM) L645.1
N$660: D646.3(COM) L646.1
N$661: D647.3(COM) L647.1
N$662: D648.3(COM) L648.1
N$663: D649.3(COM) L649.1
N$664: D650.3(COM) L650.1
N$665: D651.3(COM) L651.1
N$666: D652.3(COM) L652.1
N$667: D653.3(COM) L653.1
N$668: D654.3(COM) L654.1
N$669: D655.3(COM) L655.1
N$670: D656.3(COM) L656.1
N$687: D673.3(COM) L673.1
N$688: D674.3(COM) L674.1
N$689: D675.3(COM) L675.1
N$690: D676.3(COM) L676.1
N$691: D677.3(COM) L677.1
N$692: D678.3(COM) L678.1
N$693: D679.3(COM) L679.1
N$694: D680.3(COM) L680.1
N$695: D681.3(COM) L681.1
N$696: D682.3(COM) L682.1
N$697: D683.3(COM) L683.1
N$698: D684.3(COM) L684.1
N$699: D685.3(COM) L685.1
N$700: D686.3(COM) L686.1
N$701: D687.3(COM) L687.1
N$702: D688.3(COM) L688.1
N$719: D705.3(COM) L705.1
N$720: D706.3(COM) L706.1
N$721: D707.3(COM) L707.1
N$722: D708.3(COM) L708.1
N$723: D709.3(COM) L709.1
N$724: D710.3(COM) L710.1
N$725: D711.3(COM) L711.1
N$726: D712.3(COM) L712.1
N$727: D713.3(COM) L713.1
N$728: D714.3(COM) L714.1
N$729: D715.3(COM) L715.1
N$730: D716.3(COM) L716.1
N$731: D717.3(COM) L717.1
N$732: D718.3(COM) L718.1
N$733: D719.3(COM) L719.1
N$734: D720.3(COM) L720.1
N$751: D737.3(COM) L737.1
N$752: D738.3(COM) L738.1
N$753: D739.3(COM) L739.1
N$754: D740.3(COM) L740.1
N$755: D741.3(COM) L741.1
N$756: D742.3(COM) L742.1
N$757: D743.3(COM) L743.1
N$758: D744.3(COM) L744.1
N$759: D745.3(COM) L745.1
N$760: D746.3(COM) L746.1
N$761: D747.3(COM) L747.1
N$762: D748.3(COM) L748.1
N$763: D749.3(COM) L749.1
N$764: D750.3(COM) L750.1
N$765: D751.3(COM) L751.1
N$766: D752.3(COM) L752.1
N$783: D769.3(COM) L769.1
N$784: D770.3(COM) L770.1
N$785: D771.3(COM) L771.1
N$786: D772.3(COM) L772.1
N$787: D773.3(COM) L773.1
N$788: D774.3(COM) L774.1
N$789: D775.3(COM) L775.1
N$790: D776.3(COM) L776.1
N$791: D777.3(COM) L777.1
N$792: D778.3(COM) L778.1
N$793: D779.3(COM) L779.1
N$794: D780.3(COM) L780.1
N$795: D781.3(COM) L781.1
N$796: D782.3(COM) L782.1
N$797: D783.3(COM) L783.1
N$798: D784.3(COM) L784.1
N$815: D801.3(COM) L801.1
N$816: D802.3(COM) L802.1
N$817: D803.3(COM) L803.1
N$818: D804.3(COM) L804.1
N$819: D805.3(COM) L805.1
N$820: D806.3(COM) L806.1
N$821: D807.3(COM) L807.1
N$822: D808.3(COM) L808.1
N$823: D809.3(COM) L809.1
N$824: D810.3(COM) L810.1
N$825: D811.3(COM) L811.1
N$826: D812.3(COM) L812.1
N$827: D813.3(COM) L813.1
N$828: D814.3(COM) L814.1
N$829: D815.3(COM) L815.1
N$830: D816.3(COM) L816.1
N$847: D833.3(COM) L833.1
N$848: D834.3(COM) L834.1
N$849: D835.3(COM) L835.1
N$850: D836.3(COM) L836.1
N$851: D837.3(COM) L837.1
N$852: D838.3(COM) L838.1
N$853: D839.3(COM) L839.1
N$854: D840.3(COM) L840.1
N$855: D841.3(COM) L841.1
N$856: D842.3(COM) L842.1
N$857: D843.3(COM) L843.1
N$858: D844.3(COM) L844.1
N$859: D845.3(COM) L845.1
N$860: D846.3(COM) L846.1
N$861: D847.3(COM) L847.1
N$862: D848.3(COM) L848.1
N$879: D865.3(COM) L865.1
N$880: D866.3(COM) L866.1
N$881: D867.3(COM) L867.1
N$882: D868.3(COM) L868.1
N$883: D869.3(COM) L869.1
N$884: D870.3(COM) L870.1
N$885: D871.3(COM) L871.1
N$886: D872.3(COM) L872.1
N$887: D873.3(COM) L873.1
N$888: D874.3(COM) L874.1
N$889: D875.3(COM) L875.1
N$890: D876.3(COM) L876.1
N$891: D877.3(COM) L877.1
N$892: D878.3(COM) L878.1
N$893: D879.3(COM) L879.1
N$894: D880.3(COM) L880.1
N$911: D897.3(COM) L897.1
N$912: D898.3(COM) L898.1
N$913: D899.3(COM) L899.1
N$914: D900.3(COM) L900.1
N$915: D901.3(COM) L901.1
N$916: D902.3(COM) L902.1
N$917: D903.3(COM) L903.1
N$918: D904.3(COM) L904.1
N$919: D905.3(COM) L905.1
N$920: D906.3(COM) L906.1
N$921: D907.3(COM) L907.1
N$922: D908.3(COM) L908.1
N$923: D909.3(COM) L909.1
N$924: D910.3(COM) L910.1
N$925: D911.3(COM) L911.1
N$926: D912.3(COM) L912.1
N$943: D929.3(COM) L929.1
N$944: D930.3(COM) L930.1
N$945: D931.3(COM) L931.1
N$946: D932.3(COM) L932.1
N$947: D933.3(COM) L933.1
N$948: D934.3(COM) L934.1
N$949: D935.3(COM) L935.1
N$950: D936.3(COM) L936.1
N$951: D937.3(COM) L937.1
N$952: D938.3(COM) L938.1
N$953: D939.3(COM) L939.1
N$954: D940.3(COM) L940.1
N$955: D941.3(COM) L941.1
N$956: D942.3(COM) L942.1
N$957: D943.3(COM) L943.1
N$958: D944.3(COM) L944.1
N$975: D961.3(COM) L961.1
N$976: D962.3(COM) L962.1
N$977: D963.3(COM) L963.1
N$978: D964.3(COM) L964.1
N$979: D965.3(COM) L965.1
N$980: D966.3(COM) L966.1
N$981: D967.3(COM) L967.1
N$982: D968.3(COM) L968.1
N$983: D969.3(COM) L969.1
N$984: D970.3(COM) L970.1
N$985: D971.3(COM) L971.1
N$986: D972.3(COM) L972.1
N$987: D973.3(COM) L973.1
N$988: D974.3(COM) L974.1
N$989: D975.3(COM) L975.1
N$990: D976.3(COM) L976.1
N$1007: D993.3(COM) L993.1
N$1008: D994.3(COM) L994.1
N$1009: D995.3(COM) L995.1
N$1010: D996.3(COM) L996.1
N$1011: D997.3(COM) L997.1
N$1012: D998.3(COM) L998.1
N$1013: D999.3(COM) L999.1
N$1014: D1000.3(COM) L1000.1
N$1015: D1001.3(COM) L1001.1
N$1016: D1002.3(COM) L1002.1
N$1017: D1003.3(COM) L1003.1
N$1018: D1004.3(COM) L1004.1
N$1019: D1005.3(COM) L1005.1
N$1020: D1006.3(COM) L1006.1
N$1021: D1007.3(COM) L1007.1
N$1022: D1008.3(COM) L1008.1
ROW17_SINK: D513.1(A1) D514.1(A1) D515.1(A1) D516.1(A1) D517.1(A1) D518.1(A1) D519.1(A1) D520.1(A1) D521.1(A1) D522.1(A1) D523.1(A1) D524.1(A1) D525.1(A1) D526.1(A1) D527.1(A1) D528.1(A1) ; also sheet 2,7
ROW17_SOURCE: D513.2(C2) D514.2(C2) D515.2(C2) D516.2(C2) D517.2(C2) D518.2(C2) D519.2(C2) D520.2(C2) D521.2(C2) D522.2(C2) D523.2(C2) D524.2(C2) D525.2(C2) D526.2(C2) D527.2(C2) D528.2(C2) ; also sheet 2,7
ROW18_SINK: D545.1(A1) D546.1(A1) D547.1(A1) D548.1(A1) D549.1(A1) D550.1(A1) D551.1(A1) D552.1(A1) D553.1(A1) D554.1(A1) D555.1(A1) D556.1(A1) D557.1(A1) D558.1(A1) D559.1(A1) D560.1(A1) ; also sheet 2,7
ROW18_SOURCE: D545.2(C2) D546.2(C2) D547.2(C2) D548.2(C2) D549.2(C2) D550.2(C2) D551.2(C2) D552.2(C2) D553.2(C2) D554.2(C2) D555.2(C2) D556.2(C2) D557.2(C2) D558.2(C2) D559.2(C2) D560.2(C2) ; also sheet 2,7
ROW19_SINK: D577.1(A1) D578.1(A1) D579.1(A1) D580.1(A1) D581.1(A1) D582.1(A1) D583.1(A1) D584.1(A1) D585.1(A1) D586.1(A1) D587.1(A1) D588.1(A1) D589.1(A1) D590.1(A1) D591.1(A1) D592.1(A1) ; also sheet 2,7
ROW19_SOURCE: D577.2(C2) D578.2(C2) D579.2(C2) D580.2(C2) D581.2(C2) D582.2(C2) D583.2(C2) D584.2(C2) D585.2(C2) D586.2(C2) D587.2(C2) D588.2(C2) D589.2(C2) D590.2(C2) D591.2(C2) D592.2(C2) ; also sheet 2,7
ROW20_SINK: D609.1(A1) D610.1(A1) D611.1(A1) D612.1(A1) D613.1(A1) D614.1(A1) D615.1(A1) D616.1(A1) D617.1(A1) D618.1(A1) D619.1(A1) D620.1(A1) D621.1(A1) D622.1(A1) D623.1(A1) D624.1(A1) ; also sheet 2,7
ROW20_SOURCE: D609.2(C2) D610.2(C2) D611.2(C2) D612.2(C2) D613.2(C2) D614.2(C2) D615.2(C2) D616.2(C2) D617.2(C2) D618.2(C2) D619.2(C2) D620.2(C2) D621.2(C2) D622.2(C2) D623.2(C2) D624.2(C2) ; also sheet 2,7
ROW21_SINK: D641.1(A1) D642.1(A1) D643.1(A1) D644.1(A1) D645.1(A1) D646.1(A1) D647.1(A1) D648.1(A1) D649.1(A1) D650.1(A1) D651.1(A1) D652.1(A1) D653.1(A1) D654.1(A1) D655.1(A1) D656.1(A1) ; also sheet 2,7
ROW21_SOURCE: D641.2(C2) D642.2(C2) D643.2(C2) D644.2(C2) D645.2(C2) D646.2(C2) D647.2(C2) D648.2(C2) D649.2(C2) D650.2(C2) D651.2(C2) D652.2(C2) D653.2(C2) D654.2(C2) D655.2(C2) D656.2(C2) ; also sheet 2,7
ROW22_SINK: D673.1(A1) D674.1(A1) D675.1(A1) D676.1(A1) D677.1(A1) D678.1(A1) D679.1(A1) D680.1(A1) D681.1(A1) D682.1(A1) D683.1(A1) D684.1(A1) D685.1(A1) D686.1(A1) D687.1(A1) D688.1(A1) ; also sheet 2,7
ROW22_SOURCE: D673.2(C2) D674.2(C2) D675.2(C2) D676.2(C2) D677.2(C2) D678.2(C2) D679.2(C2) D680.2(C2) D681.2(C2) D682.2(C2) D683.2(C2) D684.2(C2) D685.2(C2) D686.2(C2) D687.2(C2) D688.2(C2) ; also sheet 2,7
ROW23_SINK: D705.1(A1) D706.1(A1) D707.1(A1) D708.1(A1) D709.1(A1) D710.1(A1) D711.1(A1) D712.1(A1) D713.1(A1) D714.1(A1) D715.1(A1) D716.1(A1) D717.1(A1) D718.1(A1) D719.1(A1) D720.1(A1) ; also sheet 2,7
ROW23_SOURCE: D705.2(C2) D706.2(C2) D707.2(C2) D708.2(C2) D709.2(C2) D710.2(C2) D711.2(C2) D712.2(C2) D713.2(C2) D714.2(C2) D715.2(C2) D716.2(C2) D717.2(C2) D718.2(C2) D719.2(C2) D720.2(C2) ; also sheet 2,7
ROW24_SINK: D737.1(A1) D738.1(A1) D739.1(A1) D740.1(A1) D741.1(A1) D742.1(A1) D743.1(A1) D744.1(A1) D745.1(A1) D746.1(A1) D747.1(A1) D748.1(A1) D749.1(A1) D750.1(A1) D751.1(A1) D752.1(A1) ; also sheet 2,7
ROW24_SOURCE: D737.2(C2) D738.2(C2) D739.2(C2) D740.2(C2) D741.2(C2) D742.2(C2) D743.2(C2) D744.2(C2) D745.2(C2) D746.2(C2) D747.2(C2) D748.2(C2) D749.2(C2) D750.2(C2) D751.2(C2) D752.2(C2) ; also sheet 2,7
ROW25_SINK: D769.1(A1) D770.1(A1) D771.1(A1) D772.1(A1) D773.1(A1) D774.1(A1) D775.1(A1) D776.1(A1) D777.1(A1) D778.1(A1) D779.1(A1) D780.1(A1) D781.1(A1) D782.1(A1) D783.1(A1) D784.1(A1) ; also sheet 2,7
ROW25_SOURCE: D769.2(C2) D770.2(C2) D771.2(C2) D772.2(C2) D773.2(C2) D774.2(C2) D775.2(C2) D776.2(C2) D777.2(C2) D778.2(C2) D779.2(C2) D780.2(C2) D781.2(C2) D782.2(C2) D783.2(C2) D784.2(C2) ; also sheet 2,7
ROW26_SINK: D801.1(A1) D802.1(A1) D803.1(A1) D804.1(A1) D805.1(A1) D806.1(A1) D807.1(A1) D808.1(A1) D809.1(A1) D810.1(A1) D811.1(A1) D812.1(A1) D813.1(A1) D814.1(A1) D815.1(A1) D816.1(A1) ; also sheet 2,7
ROW26_SOURCE: D801.2(C2) D802.2(C2) D803.2(C2) D804.2(C2) D805.2(C2) D806.2(C2) D807.2(C2) D808.2(C2) D809.2(C2) D810.2(C2) D811.2(C2) D812.2(C2) D813.2(C2) D814.2(C2) D815.2(C2) D816.2(C2) ; also sheet 2,7
ROW27_SINK: D833.1(A1) D834.1(A1) D835.1(A1) D836.1(A1) D837.1(A1) D838.1(A1) D839.1(A1) D840.1(A1) D841.1(A1) D842.1(A1) D843.1(A1) D844.1(A1) D845.1(A1) D846.1(A1) D847.1(A1) D848.1(A1) ; also sheet 2,7
ROW27_SOURCE: D833.2(C2) D834.2(C2) D835.2(C2) D836.2(C2) D837.2(C2) D838.2(C2) D839.2(C2) D840.2(C2) D841.2(C2) D842.2(C2) D843.2(C2) D844.2(C2) D845.2(C2) D846.2(C2) D847.2(C2) D848.2(C2) ; also sheet 2,7
ROW28_SINK: D865.1(A1) D866.1(A1) D867.1(A1) D868.1(A1) D869.1(A1) D870.1(A1) D871.1(A1) D872.1(A1) D873.1(A1) D874.1(A1) D875.1(A1) D876.1(A1) D877.1(A1) D878.1(A1) D879.1(A1) D880.1(A1) ; also sheet 2,7
ROW28_SOURCE: D865.2(C2) D866.2(C2) D867.2(C2) D868.2(C2) D869.2(C2) D870.2(C2) D871.2(C2) D872.2(C2) D873.2(C2) D874.2(C2) D875.2(C2) D876.2(C2) D877.2(C2) D878.2(C2) D879.2(C2) D880.2(C2) ; also sheet 2,7
ROW29_SINK: D897.1(A1) D898.1(A1) D899.1(A1) D900.1(A1) D901.1(A1) D902.1(A1) D903.1(A1) D904.1(A1) D905.1(A1) D906.1(A1) D907.1(A1) D908.1(A1) D909.1(A1) D910.1(A1) D911.1(A1) D912.1(A1) ; also sheet 2,7
ROW29_SOURCE: D897.2(C2) D898.2(C2) D899.2(C2) D900.2(C2) D901.2(C2) D902.2(C2) D903.2(C2) D904.2(C2) D905.2(C2) D906.2(C2) D907.2(C2) D908.2(C2) D909.2(C2) D910.2(C2) D911.2(C2) D912.2(C2) ; also sheet 2,7
ROW30_SINK: D929.1(A1) D930.1(A1) D931.1(A1) D932.1(A1) D933.1(A1) D934.1(A1) D935.1(A1) D936.1(A1) D937.1(A1) D938.1(A1) D939.1(A1) D940.1(A1) D941.1(A1) D942.1(A1) D943.1(A1) D944.1(A1) ; also sheet 2,7
ROW30_SOURCE: D929.2(C2) D930.2(C2) D931.2(C2) D932.2(C2) D933.2(C2) D934.2(C2) D935.2(C2) D936.2(C2) D937.2(C2) D938.2(C2) D939.2(C2) D940.2(C2) D941.2(C2) D942.2(C2) D943.2(C2) D944.2(C2) ; also sheet 2,7
ROW31_SINK: D961.1(A1) D962.1(A1) D963.1(A1) D964.1(A1) D965.1(A1) D966.1(A1) D967.1(A1) D968.1(A1) D969.1(A1) D970.1(A1) D971.1(A1) D972.1(A1) D973.1(A1) D974.1(A1) D975.1(A1) D976.1(A1) ; also sheet 2,7
ROW31_SOURCE: D961.2(C2) D962.2(C2) D963.2(C2) D964.2(C2) D965.2(C2) D966.2(C2) D967.2(C2) D968.2(C2) D969.2(C2) D970.2(C2) D971.2(C2) D972.2(C2) D973.2(C2) D974.2(C2) D975.2(C2) D976.2(C2) ; also sheet 2,7
ROW32_SINK: D993.1(A1) D994.1(A1) D995.1(A1) D996.1(A1) D997.1(A1) D998.1(A1) D999.1(A1) D1000.1(A1) D1001.1(A1) D1002.1(A1) D1003.1(A1) D1004.1(A1) D1005.1(A1) D1006.1(A1) D1007.1(A1) D1008.1(A1) ; also sheet 2,7
ROW32_SOURCE: D993.2(C2) D994.2(C2) D995.2(C2) D996.2(C2) D997.2(C2) D998.2(C2) D999.2(C2) D1000.2(C2) D1001.2(C2) D1002.2(C2) D1003.2(C2) D1004.2(C2) D1005.2(C2) D1006.2(C2) D1007.2(C2) D1008.2(C2) ; also sheet 2,7